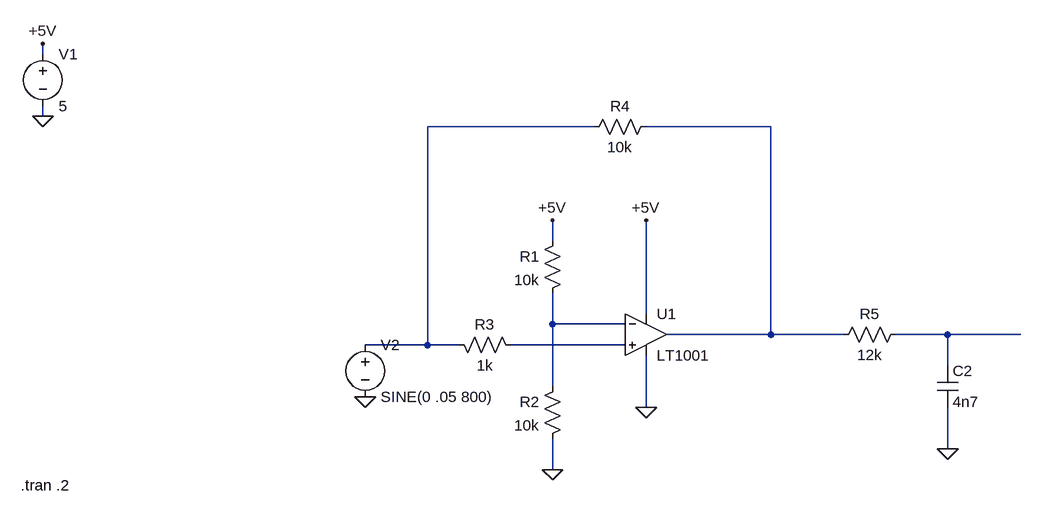
[diagram p0: schematic preamp_opamp.asc]
preamp_opamp.asc, the LTspice schematic file:
Version 4
SHEET 1 880 680
WIRE -768 -272 -768 -288
WIRE -768 -176 -768 -192
WIRE 80 -160 -176 -160
WIRE 352 -160 160 -160
WIRE 16 16 16 -16
WIRE 160 128 160 -16
WIRE 16 144 16 96
WIRE 128 144 16 144
WIRE 352 160 352 -160
WIRE 352 160 192 160
WIRE 464 160 352 160
WIRE 624 160 544 160
WIRE 736 160 624 160
WIRE -176 176 -176 -160
WIRE -176 176 -272 176
WIRE -128 176 -176 176
WIRE 128 176 -48 176
WIRE 624 208 624 160
WIRE 16 240 16 144
WIRE 160 272 160 192
WIRE 624 336 624 272
WIRE 16 368 16 320
FLAG 16 -16 +5V
FLAG 160 -16 +5V
FLAG 160 272 0
FLAG 16 368 0
FLAG 624 336 0
FLAG -768 -288 +5V
FLAG -768 -176 0
FLAG -272 256 0
SYMBOL res 32 0 M0
SYMATTR InstName R1
SYMATTR Value 10k
SYMBOL res 32 224 M0
SYMATTR InstName R2
SYMATTR Value 10k
SYMBOL res 176 -176 R90
WINDOW 0 0 56 VBottom 2
WINDOW 3 32 56 VTop 2
SYMATTR InstName R4
SYMATTR Value 10k
SYMBOL res 560 144 R90
WINDOW 0 0 56 VBottom 2
WINDOW 3 32 56 VTop 2
SYMATTR InstName R5
SYMATTR Value 12k
SYMBOL cap 608 208 R0
SYMATTR InstName C2
SYMATTR Value 4n7
SYMBOL res -32 192 M270
WINDOW 0 32 56 VTop 2
WINDOW 3 0 56 VBottom 2
SYMATTR InstName R3
SYMATTR Value 1k
SYMBOL voltage -768 -288 R0
WINDOW 123 0 0 Left 2
WINDOW 39 0 0 Left 2
SYMATTR InstName V1
SYMATTR Value 5
SYMBOL Opamps\\LT1001 160 96 R0
SYMATTR InstName U1
SYMBOL voltage -272 160 R0
WINDOW 123 0 0 Left 2
WINDOW 39 0 0 Left 2
SYMATTR InstName V2
SYMATTR Value SINE(0 .05 800)
TEXT -802 392 Left 2 !.tran .2

The netlist it stands for:
* preamp_opamp.asc
R1 +5V N003 10k
R2 N003 0 10k
R4 N002 N001 10k
R5 N004 N002 12k
C2 N004 0 4n7
R3 N005 N001 1k
V1 +5V 0 5
XU1 N005 N003 +5V 0 N002 LT1001  ; pins In+ In- V+ V- OUT
V2 N001 0 SINE(0 .05 800)
.tran .2
.lib LTC.lib
.backanno
.end